# Altium schematic sheet ADC_LEVEL_SHIFT.SchDoc
size A4; Author: Mostafa_Bakir; SheetNumber: 5; SheetTotal: 6
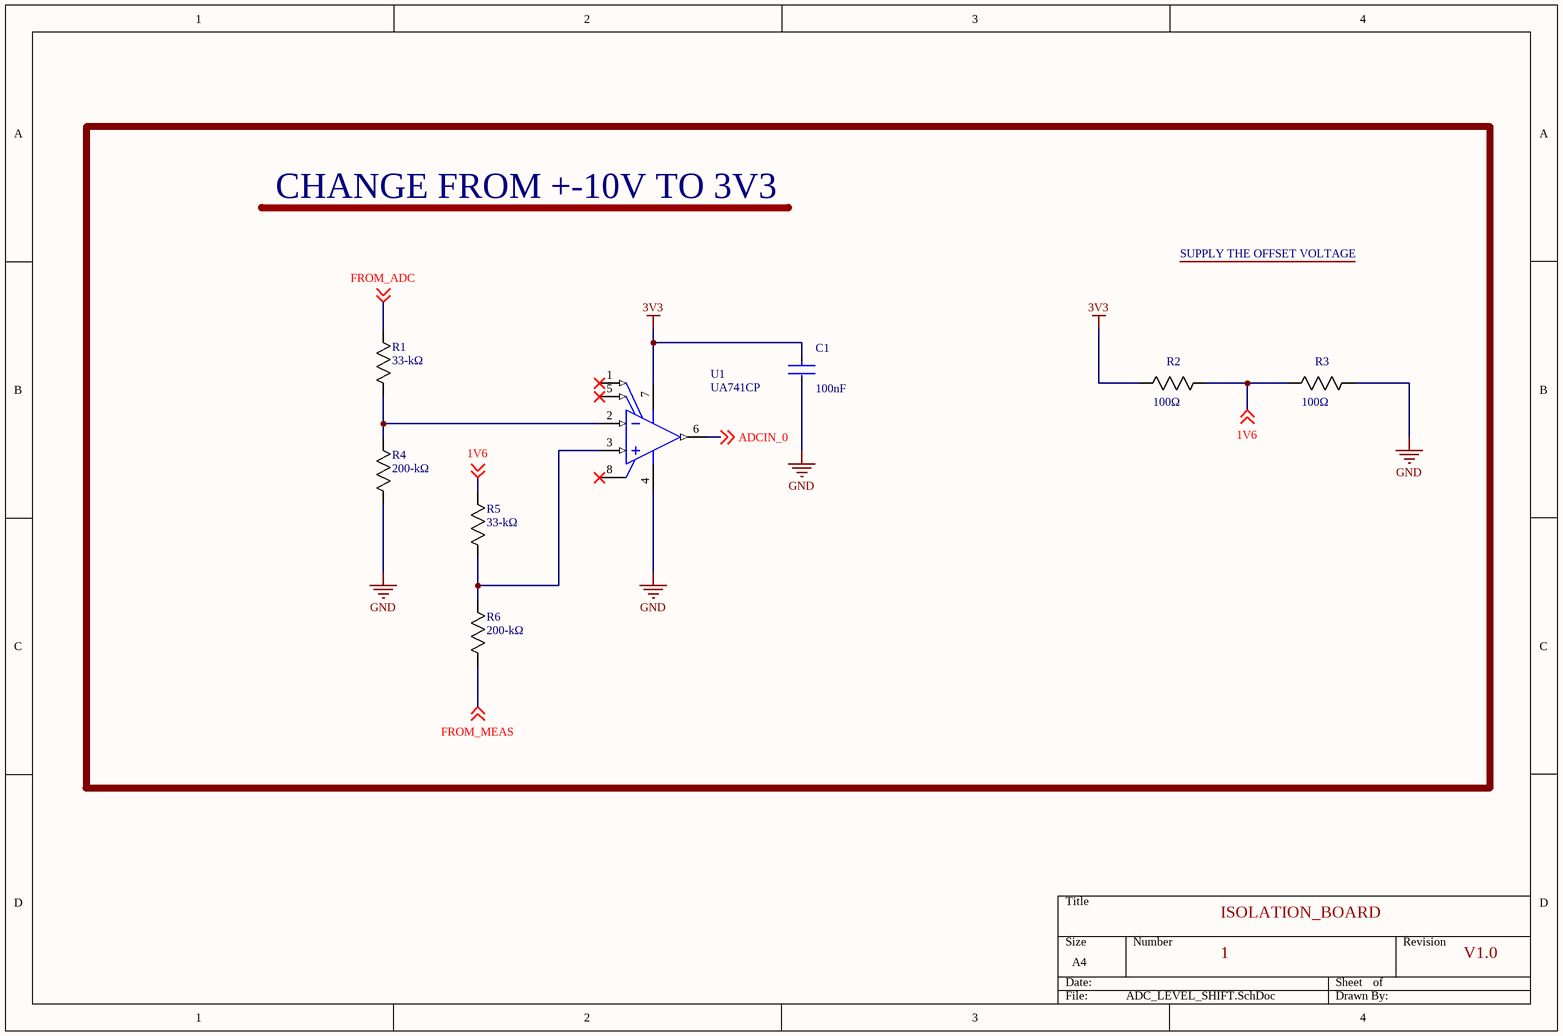
[diagram p0: ADC_LEVEL_SHIFT.SchDoc]

## Parts
C1  Capacitance: 100nF  [FP-K15H5-MFG]  (hidden comment: K104K15X7RF53H5)
R1  Resistance: 33-kΩ  [RES_AC03_VIS]  (hidden comment: AC03000008208JAC00)
R2  Resistance: 100Ω  [RES_AC03_VIS]  (hidden comment: AC03000008208JAC00)
R3  Resistance: 100Ω  [RES_AC03_VIS]  (hidden comment: AC03000008208JAC00)
R4  Resistance: 200-kΩ  [RES_AC03_VIS]  (hidden comment: AC03000008208JAC00)
R5  Resistance: 33-kΩ  [RES_AC03_VIS]  (hidden comment: AC03000008208JAC00)
R6  Resistance: 200-kΩ  [RES_AC03_VIS]  (hidden comment: AC03000008208JAC00)
U1  UA741CP  [P0008A]

## Nets
3V3: C1.1 R2.1 U1.7(VCC+)
GND: C1.2 R3.2 R4.1 U1.4(VCC-)
1V6: R2.2 R3.1 R5.2 ; off-sheet 1V6
ADCIN_0: U1.6(OUT) ; off-sheet ADCIN_0
FROM_ADC: R1.2 ; off-sheet FROM_ADC
FROM_MEAS: R6.1 ; off-sheet FROM_MEAS
NetR1_1: R1.1 R4.2 U1.2(IN-)
NetR5_1: R5.1 R6.2 U1.3(IN+)

Not connected (* = marked no-connect by the designer): U1 1(OFFSET_N1)* 5(OFFSET_N2)* 8(NC)*

## Notes on the sheet
- CHANGE FROM +-10V TO 3V3
- SUPPLY THE OFFSET VOLTAGE
- ISOLATION_BOARD
- 1
- V1.0

## Library data of the parts
C1 = CMP-02417-000048-1: CAP CER 0.1UF 50V X7R RADIAL; Tolerance: 10%; Lead/Base Style: Formed Leads; Lead Length: 30mm; Lead Diameter: 0.5mm; Radiation Hardening: No; Lead Pitch: 5mm; Voltage: 50V; Mount: Through Hole; Package Quantity: 5000; Series: K; Case/Package: Dipped; Min Operating Temperature: -55°C; Depth: 2.5mm; Height - Seated (Max): 0.1inch; Voltage Rating (DC): 50V; Packaging: Bulk; RoHS Compliant: Yes; Construction: RADIAL; Thickness: 2.6mm; Max Operating Temperature: 125°C; Voltage Rating: 50V; Diameter: 500um; Dielectric: X7R; Width: 2.5mm; Length: 4mm; Weight: 0.005644oz; Termination: Radial; Height: 4mm; ComponentLink1Description: BUY; ComponentLink1URL: https://makerselectronics.com/product/ceramic-capacitor-100nf-50v
R1-R6 = CMP-00030-43026420-1: AC03000008208JAC00 AC03 Series Axial Wirewound Resistor 8.2Ohms +/-5% 3W -80 - -10ppm/degC; Tolerance: 5%; Temperature Coefficient: -10ppm/°C; Thickness: 4.8006mm; Radiation Hardening: No; Min Operating Temperature: -40°C; Case/Package: Axial; Packaging: Tape & Box (TB); Termination: Axial; Power Rating: 3W; Width: 4.8006mm; Military Standard: Not; Diameter: 4.8mm; RoHS: Compliant; Contact Plating: Tin; NexarPartId: 43026420; Composition: Wirewound; Features: Flame Retardant Coating; Number of Terminations: 2; Length: 13mm; Max Power Dissipation: 3W; Mount: Through Hole; Max Operating Temperature: 200°C
U1 = CMP-0017-00973-2: General-Purpose Operational Amplifier, 7 to 36 V, 0 to 70 degC, 8-pin DIP (P8), Pb-Free (RoHS); Manufacturer: Texas Instruments; Iq per channel(Max)(mA): 2.8; Number of Channels: 1; Total Supply Voltage(Min)(+5V is 5, +/-5V is 10): 7; IIB(Max)(pA): 800000; Slew Rate(Typ)(V/us): 0.5; Total Supply Voltage(Max)(+5V is 5, +/-5V is 10): 36; Vio (25C)(Max)(mV): 6; CMRR(Min)(dB): 70; Sub Family: General Purpose Amplifier, High Supply Voltage Amplifier (>=30V); PackageVersion: 4040082/E, 04/2010; PackageReference: P0008A; ComponentLink1URL: http://www.ti.com/; Mounting Technology: Through Hole; ComponentLink1Description: Manufacturer URL; GBW(Typ)(MHz): 1; ComponentLink2Description: Datasheet; ComponentLink2URL: http://www.ti.com/lit/ds/symlink/ua741.pdf; PartNumber: UA741CP; Code_JEDEC: MS-001; ComponentLink3Description: Package Specification; DatasheetVersion: SLOS094B; ComponentLink3URL: http://www.ti.com/litv/pdf/mpdi001b; PackageDescription: 8-Pin Plastic In-Line, Body 9.59 x 6.35 mm, Pitch 2.54 mm; Eco-Plan: Pb-Free (RoHS); ComponentLink4Description: BUY; ComponentLink4URL: https://makerselectronics.com/product/ua741